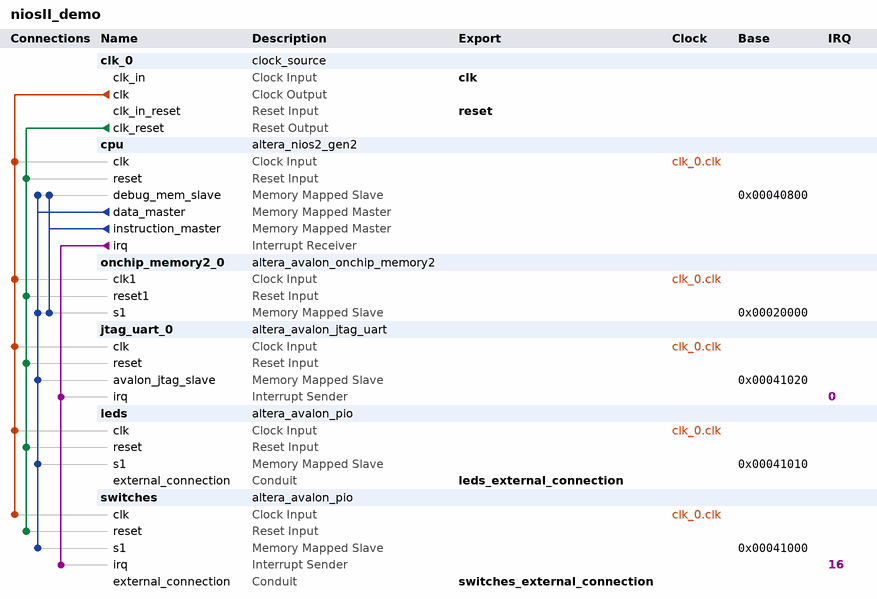
[diagram p0: system contents]
# Platform Designer (Qsys) system niosII_demo, MAX 10 10M50DAF484C6GES
# Parameters at their usual value, and those the tool derives, are not listed.
package require -exact qsys 22.1
create_system niosII_demo
set_project_property DEVICE_FAMILY {MAX 10}
set_project_property DEVICE 10M50DAF484C6GES

add_instance clk_0 clock_source 22.1
set_instance_parameter_value clk_0 clockFrequency 50000000

add_instance cpu altera_nios2_gen2 22.1
set_instance_parameter_value cpu dcache_size 2048
set_instance_parameter_value cpu exceptionSlave onchip_memory2_0.s1
set_instance_parameter_value cpu icache_size 4096
set_instance_parameter_value cpu impl Fast
set_instance_parameter_value cpu resetSlave onchip_memory2_0.s1

add_instance onchip_memory2_0 altera_avalon_onchip_memory2 22.1
set_instance_parameter_value onchip_memory2_0 dataWidth 32
set_instance_parameter_value onchip_memory2_0 dualPort false
set_instance_parameter_value onchip_memory2_0 initMemContent true
set_instance_parameter_value onchip_memory2_0 initializationFileName onchip_mem.hex
set_instance_parameter_value onchip_memory2_0 memorySize 94876

add_instance jtag_uart_0 altera_avalon_jtag_uart 22.1
set_instance_parameter_value jtag_uart_0 simInteractiveOptions NO_INTERACTIVE_WINDOWS

add_instance leds altera_avalon_pio 22.1
set_instance_parameter_value leds direction Output
set_instance_parameter_value leds width 10

add_instance switches altera_avalon_pio 22.1
set_instance_parameter_value switches direction Input
set_instance_parameter_value switches generateIRQ true
set_instance_parameter_value switches width 10

# connections
add_connection clk_0.clk cpu.clk clock
add_connection clk_0.clk jtag_uart_0.clk clock
add_connection clk_0.clk leds.clk clock
add_connection clk_0.clk onchip_memory2_0.clk1 clock
add_connection clk_0.clk switches.clk clock
add_connection clk_0.clk_reset cpu.reset reset
add_connection clk_0.clk_reset jtag_uart_0.reset reset
add_connection clk_0.clk_reset leds.reset reset
add_connection clk_0.clk_reset onchip_memory2_0.reset1 reset
add_connection clk_0.clk_reset switches.reset reset
add_connection cpu.data_master cpu.debug_mem_slave avalon
set_connection_parameter_value cpu.data_master/cpu.debug_mem_slave baseAddress 0x00040800
add_connection cpu.data_master jtag_uart_0.avalon_jtag_slave avalon
set_connection_parameter_value cpu.data_master/jtag_uart_0.avalon_jtag_slave baseAddress 0x00041020
add_connection cpu.data_master leds.s1 avalon
set_connection_parameter_value cpu.data_master/leds.s1 baseAddress 0x00041010
add_connection cpu.data_master onchip_memory2_0.s1 avalon
set_connection_parameter_value cpu.data_master/onchip_memory2_0.s1 baseAddress 0x00020000
add_connection cpu.data_master switches.s1 avalon
set_connection_parameter_value cpu.data_master/switches.s1 baseAddress 0x00041000
add_connection cpu.instruction_master cpu.debug_mem_slave avalon
set_connection_parameter_value cpu.instruction_master/cpu.debug_mem_slave baseAddress 0x00040800
add_connection cpu.instruction_master onchip_memory2_0.s1 avalon
set_connection_parameter_value cpu.instruction_master/onchip_memory2_0.s1 baseAddress 0x00020000
add_connection cpu.irq jtag_uart_0.irq interrupt
set_connection_parameter_value cpu.irq/jtag_uart_0.irq irqNumber 0
add_connection cpu.irq switches.irq interrupt
set_connection_parameter_value cpu.irq/switches.irq irqNumber 16

# exported interfaces
add_interface clk clock sink
set_interface_property clk EXPORT_OF clk_0.clk_in
add_interface leds_external_connection conduit end
set_interface_property leds_external_connection EXPORT_OF leds.external_connection
add_interface reset reset sink
set_interface_property reset EXPORT_OF clk_0.clk_in_reset
add_interface switches_external_connection conduit end
set_interface_property switches_external_connection EXPORT_OF switches.external_connection

set_interconnect_requirement {$system} qsys_mm.clockCrossingAdapter HANDSHAKE
set_interconnect_requirement {$system} qsys_mm.enableEccProtection FALSE
set_interconnect_requirement {$system} qsys_mm.insertDefaultSlave FALSE
set_interconnect_requirement {$system} qsys_mm.maxAdditionalLatency 1

save_system niosII_demo.qsys
